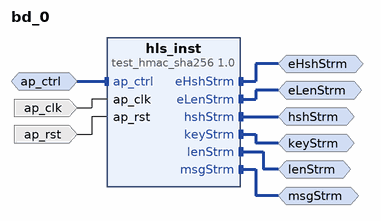
[diagram p0: block diagram of the top level]
# Vivado block design bd_0, xc7z020clg484-1, Vivado 2024.2
create_bd_design bd_0

create_bd_intf_port -mode Slave -vlnv xilinx.com:interface:acc_handshake_rtl:1.0 ap_ctrl
create_bd_intf_port -mode Master -vlnv xilinx.com:interface:acc_fifo_write_rtl:1.0 eHshStrm
create_bd_intf_port -mode Master -vlnv xilinx.com:interface:acc_fifo_read_rtl:1.0 eLenStrm
create_bd_intf_port -mode Master -vlnv xilinx.com:interface:acc_fifo_write_rtl:1.0 hshStrm
create_bd_intf_port -mode Master -vlnv xilinx.com:interface:acc_fifo_read_rtl:1.0 keyStrm
create_bd_intf_port -mode Master -vlnv xilinx.com:interface:acc_fifo_read_rtl:1.0 lenStrm
create_bd_intf_port -mode Master -vlnv xilinx.com:interface:acc_fifo_read_rtl:1.0 msgStrm
create_bd_port -dir I -type clk ap_clk
set_property -dict {CONFIG.FREQ_HZ 66000000.0} [get_bd_ports ap_clk]
create_bd_port -dir I -type rst ap_rst
set_property -dict {CONFIG.POLARITY ACTIVE_HIGH} [get_bd_ports ap_rst]

create_bd_cell -type ip -vlnv xilinx.com:hls:test_hmac_sha256:1.0 hls_inst

# ---- connections ----

connect_bd_intf_net -intf_net ap_ctrl_0_1 [get_bd_intf_ports ap_ctrl] [get_bd_intf_pins hls_inst/ap_ctrl]
connect_bd_intf_net [get_bd_intf_ports eHshStrm] [get_bd_intf_pins hls_inst/eHshStrm]
connect_bd_intf_net [get_bd_intf_ports eLenStrm] [get_bd_intf_pins hls_inst/eLenStrm]
connect_bd_intf_net [get_bd_intf_ports hshStrm] [get_bd_intf_pins hls_inst/hshStrm]
connect_bd_intf_net [get_bd_intf_ports keyStrm] [get_bd_intf_pins hls_inst/keyStrm]
connect_bd_intf_net [get_bd_intf_ports lenStrm] [get_bd_intf_pins hls_inst/lenStrm]
connect_bd_intf_net [get_bd_intf_ports msgStrm] [get_bd_intf_pins hls_inst/msgStrm]
connect_bd_net -net ap_clk_0_1 [get_bd_ports ap_clk] [get_bd_pins hls_inst/ap_clk]
connect_bd_net -net ap_rst_0_1 [get_bd_ports ap_rst] [get_bd_pins hls_inst/ap_rst]

validate_bd_design
save_bd_design
